# Altium schematic sheet Amplifier.SchDoc: Наименование
size 209 x 297 mm; ApprovedBy: Утвердил; CheckedBy: Проверил; Author: Разработал; CompanyName: Организация; DrawnBy: Н.Контр; Engineer: Т.Контр; SheetNumber: 4; SheetTotal: 6; PageSetup: Record=PageOptions|CenterHorizontal=True|CenterVertical=True|PrintScale=0.94|XCorrection=1.00|YCorrection=1.00|PrintKind=1|BorderSize=5000000|LeftOffset=0|BottomOffset=0|Orientation=1|PaperLength=1000|PaperWidth=1000|Scale=100|PaperSource=7|PrintQuality=-4|MediaType=1|DitherType=10|PaperKind=A4|PrintScaleMode=1; DecimalNumber: Децимальный номер; HeadOfSector: Нач. сектора; MainDevice: Перв.примен.; Name: Наименование; DocumentName: Sheet1.SCHDOC
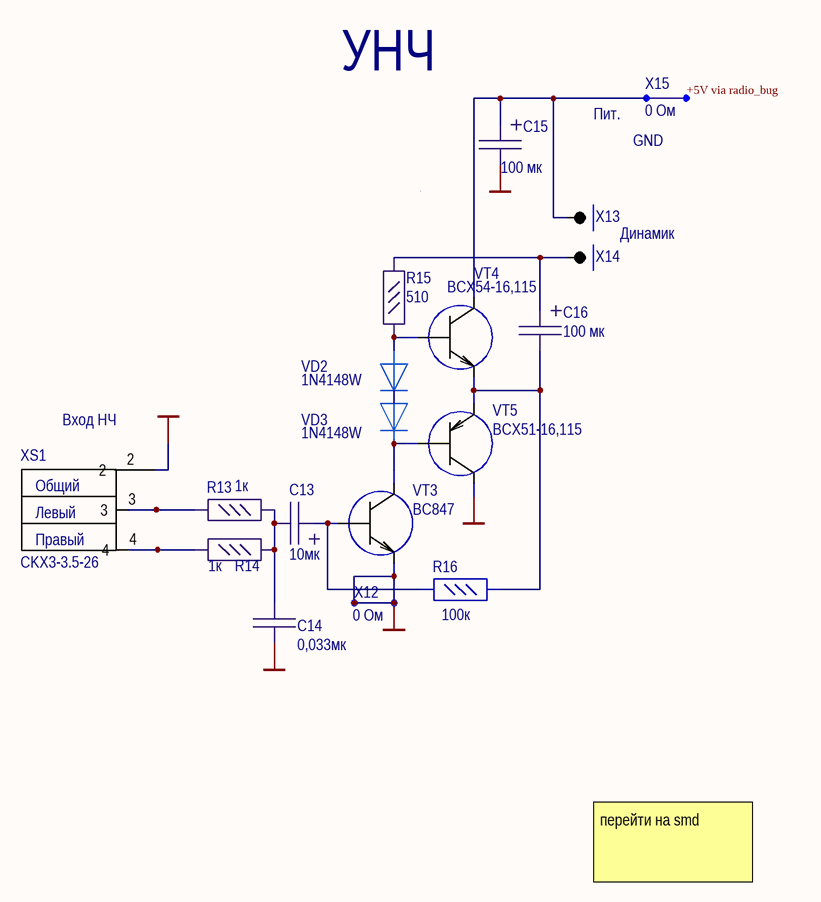
[diagram p0: Amplifier.SchDoc]

## Parts
C13  10мк  [C_CASE]
C14  0,033мк  [C_0805]
C15  100 мк  [SMD_al_cap_0605_6.3]
C16  100 мк  [C_CASE]
R13  1к  [R_0805]
R14  1к  [R_0805]
R15  510  [R_0805]
R16  100к  [R_0805]
VD2  1N4148W  [SOD-80]
VD3  1N4148W  [SOD-80]
VT3  BC847  [SOT23]
VT4  BCX54-16,115  [SOT89]
VT5  BCX51-16,115  [SOT89]
X12  0 Ом  [jumper]
X13  КТ  [PLS-1]  (value not drawn)
X14  КТ  [PLS-1]  (value not drawn)
X15  0 Ом  [jumper]
XS1  CKX3-3.5-26  [CKX3-3.5-26]

## Nets
GND: C14.1 C15.2 VT3.2(E) VT5.2(C) X12.1 X12.2 XS1.2
+5V via radio_bug: X15.2
NetC13_1: C13.1 R16.2 VT3.1(B)
NetC13_2: C13.2 C14.2 R13.2 R14.2
NetC15_1: C15.1 VT4.2(C) X13.1 X15.1
NetC16_1: C16.1 R15.2 X14.1
NetC16_2: C16.2 R16.1 VT4.3(E) VT5.3(E)
NetR13_1: R13.1 XS1.3
NetR14_1: R14.1 XS1.4
NetR15_1: R15.1 VD2.1 VT4.1(B)
NetVD2_2: VD2.2 VD3.1
NetVD3_2: VD3.2 VT3.3(C) VT5.1(B)

## Notes on the sheet
- УНЧ
- (near X15) Пит.
- (near X15) GND
- Динамик
- (near XS1) Вход НЧ
- перейти на smd
- Подп. и дата
- Инв.№ дубл.
- Взам.инв.№
- Подп.и дата
- Инв.№ подл.
- Изм.
- Лист
- № докум.
- Подп.
- Дата
- Формат  A4
- (in symbol CKX3-3.5-26) Общий; Левый; Правый

## Library data of the parts
C13 C15 C16 = TAJB107K004RNJ: CAP TANT 100UF 10% 4V 1411; Manufacturer: AVX Corporation; Value: 100µF; Part Number: TAJB107K004RNJ; ComponentLink1URL: http://datasheets.avx.com/TAJ.pdf; ComponentLink1Description: Datasheet; Component Type: Tantalum Capacitor
C14 = GRM188R72A104KA35D: Manufacturer: Murata Electronics; Value: 0.1µF; Part Number: GRM188R72A104KA35D; ComponentLink1URL: https://www.murata.com/~/media/webrenewal/support/library/catalog/products/capacitor/mlcc/c02e.ashx?la=en-us; ComponentLink1Description: Datasheet; Component Type: Capasitor
R13 R14 = CR0603-FX-1002ELF: RES SMD 10K OHM 1% 1/10W 0603; Manufacturer: Bourns Inc.; Value: 10 к; Part Number: CR0603-FX-1002ELF; ComponentLink1URL: https://www.bourns.com/pdfs/chpreztr.pdf; ComponentLink1Description: Datasheet; Component Type: Resistor
R15 = CR0603-FX-1002ELF: Manufacturer: Bourns Inc.; Value: 10 к; Part Number: CR0603-FX-1002ELF; ComponentLink1URL: https://www.bourns.com/pdfs/chpreztr.pdf; ComponentLink1Description: Datasheet; Component Type: Resistor
R16 = R_C1-4
VD2 VD3 = LL4148-GS08: Диод
VT5 = BCX51-16,115_1
X12 X15 = 0 Ohm (0805)